# EAGLE design integratedCEE (EAGLE 5.07)
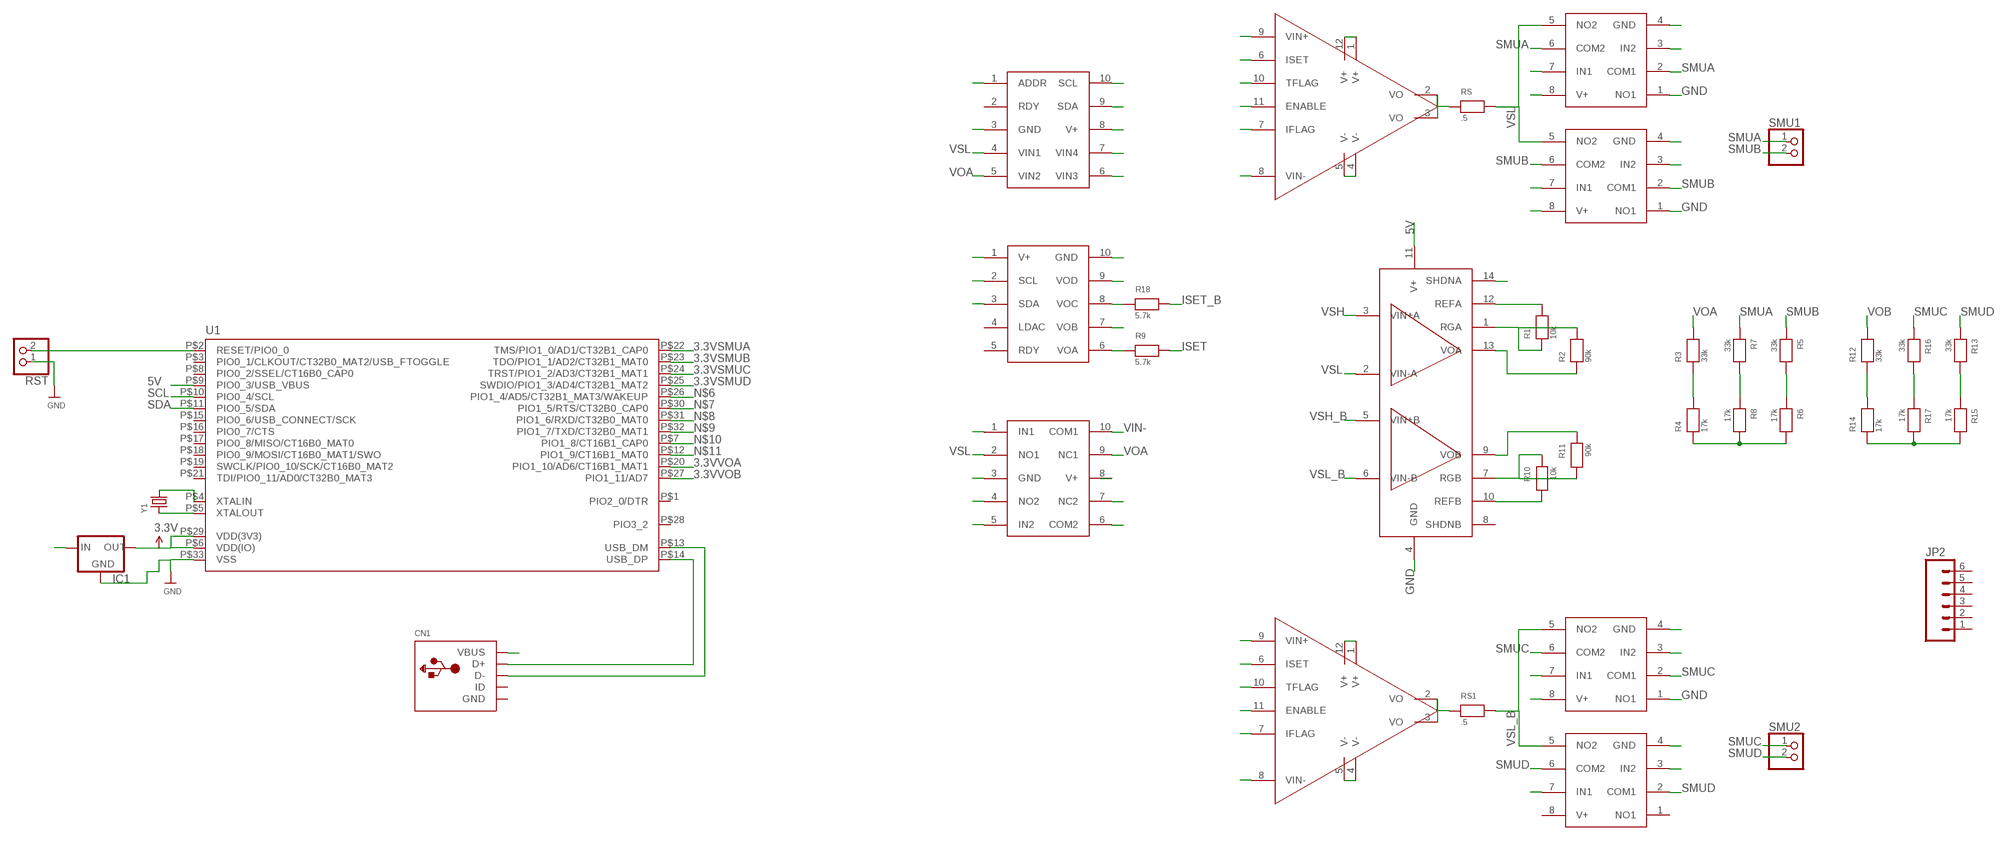
[diagram p0: schematic, sheet 1]

## Parts
ADC  ADS1015  [MSOP10]
CN1  USBMINIB  [USB-MINIB]
DAC  MCP4728  [MSOP10]
IC1  MCP1700SOT23-3  [SOT23]
INSA  INA2332  INA2332INA2332  [TSSOP14]
JP2  M06RA  [MOLEX-1X6-RA]
OPA  OPA567  [QFN12]
OPA1  OPA567  [QFN12]
R1  10k  RESISTOR0603  [0603]
R2  90k  RESISTOR0603  [0603]
R3  33k  RESISTOR0603  [0603]
R4  17k  RESISTOR0603  [0603]
R5  33k  RESISTOR0603  [0603]
R6  17k  RESISTOR0603  [0603]
R7  33k  RESISTOR0603  [0603]
R8  17k  RESISTOR0603  [0603]
R9  5.7k  RESISTOR0603  [0603]
R10  10k  RESISTOR0603  [0603]
R11  90k  RESISTOR0603  [0603]
R12  33k  RESISTOR0603  [0603]
R13  33k  RESISTOR0603  [0603]
R14  17k  RESISTOR0603  [0603]
R15  17k  RESISTOR0603  [0603]
R16  33k  RESISTOR0603  [0603]
R17  17k  RESISTOR0603  [0603]
R18  5.7k  RESISTOR0603  [0603]
RS  .5  RESISTOR2512  [2512]
RS1  .5  RESISTOR2512  [2512]
RST  HEADER-1X2ROUND  [1X02_ROUND]
SMU1  HEADER-1X2ROUND  [1X02_ROUND]
SMU2  HEADER-1X2ROUND  [1X02_ROUND]
SWA  TS5A21366  TS5A21366TS5A21366  [DCU8]
SWA1  TS5A21366  TS5A21366TS5A21366  [DCU8]
SWB  TS5A21366  TS5A21366TS5A21366  [DCU8]
SWB1  TS5A21366  TS5A21366TS5A21366  [DCU8]
SWC  TS5A23157  TS5A23157DGSR  [MSOP10]
U1  LPC1343_QFN  [HVQFN33-7X7]
Y1  CRYSTALSMD  [HC49UP]

## Nets
3.3V: IC1.2(OUT) U1.P$6(VDD(IO)) U1.P$29(VDD(3V3))
3.3VSMUA: R7.2 R8.1 U1.P$22(TMS/PIO1_0/AD1/CT32B1_CAP0)
3.3VSMUB: R5.2 R6.1 U1.P$23(TDO/PIO1_1/AD2/CT32B1_MAT0)
3.3VSMUC: R16.2 R17.1 U1.P$24(TRST/PIO1_2/AD3/CT32B1_MAT1)
3.3VSMUD: R13.2 R15.1 U1.P$25(SWDIO/PIO1_3/AD4/CT32B1_MAT2)
3.3VVOA: R3.1 R4.2 U1.P$20(PIO1_10/AD6/CT16B1_MAT1)
3.3VVOB: R12.1 R14.2 U1.P$27(PIO1_11/AD7)
5V: ADC.8(V+) CN1.VBUS DAC.1(V+) IC1.3(IN) INSA.11(V+) INSA.14(SHDNA) OPA1.1(V+) OPA1.12(V+) OPA.1(V+) OPA.12(V+) SWA1.8(V+) SWA.8(V+) SWB.8(V+) SWC.8(V+) U1.P$9(PIO0_3/USB_VBUS)
ENABLE: OPA.11(ENABLE)
ENABLE1_B: OPA1.11(ENABLE)
GND: ADC.1(ADDR) ADC.3(GND) DAC.10(GND) IC1.1(GND) INSA.4(GND) OPA1.4(V-) OPA1.5(V-) OPA.4(V-) OPA.5(V-) R4.1 R6.2 R8.2 R14.1 R15.2 R17.2 RST.1 SWA1.1(NO1) SWA1.4(GND) SWA.1(NO1) SWA.4(GND) SWB1.4(GND) SWB.1(NO1) SWB.4(GND) SWC.3(GND) U1.P$33(VSS)
IFLAG: OPA.7(IFLAG)
IFLAG1_B: OPA1.7(IFLAG)
ISET: OPA.6(ISET) R9.2
ISET_B: OPA1.6(ISET) R18.2
N$1: DAC.6(VOA) R9.1
N$2: SWC.4(NO2)
N$3: R18.1
N$4: CN1.D+ U1.P$14(USB_DP)
N$5: CN1.D- U1.P$13(USB_DM)
N$6: U1.P$26(PIO1_4/AD5/CT32B1_MAT3/WAKEUP)
N$7: U1.P$30(PIO1_5/RTS/CT32B0_CAP0)
N$8: U1.P$31(PIO1_6/RXD/CT32B0_MAT0)
N$9: U1.P$32(PIO1_7/TXD/CT32B0_MAT1)
N$10: U1.P$7(PIO1_8/CT16B1_CAP0)
N$11: U1.P$12(PIO1_9/CT16B1_MAT0)
N$12: U1.P$5(XTALOUT) Y1.1
N$13: U1.P$4(XTALIN) Y1.2
REFA: INSA.12(REFA) R1.2
REFB: INSA.10(REFB) R10.2
RESET: RST.2 U1.P$2(RESET/PIO0_0)
RGA: INSA.1(RGA) R1.1 R2.2
RGB: INSA.7(RGB) R10.1 R11.2
SCL: ADC.10(SCL) DAC.2(SCL) U1.P$10(PIO0_4/SCL)
SDA: ADC.9(SDA) DAC.3(SDA) U1.P$11(PIO0_5/SDA)
SMUA: R7.1 SMU1.1 SWA.2(COM1) SWA.6(COM2)
SMUB: R5.1 SMU1.2 SWB.2(COM1) SWB.6(COM2)
SMUC: R16.1 SMU2.1 SWA1.2(COM1) SWA1.6(COM2)
SMUD: R13.1 SMU2.2 SWB1.2(COM1) SWB1.6(COM2)
SWAIN1: SWA.7(IN1)
SWAIN2: SWA.3(IN2)
SWAIN3: SWA1.7(IN1)
SWAIN4: SWA1.3(IN2)
SWBIN1: SWB.7(IN1)
SWBIN2: SWB.3(IN2)
SWBIN3: SWB1.3(IN2)
SWBIN4: SWB1.7(IN1)
SWCIN1: SWC.1(IN1)
SWCIN1_B: SWC.5(IN2)
TFLAG: OPA.10(TFLAG)
TFLAG1_B: OPA1.10(TFLAG)
VIN+: DAC.7(VOB) OPA.9(VIN+)
VIN+_B: DAC.9(VOD) OPA1.9(VIN+)
VIN-: OPA.8(VIN-) SWC.10(COM1)
VIN-_B: OPA1.8(VIN-) SWC.6(COM2)
VOA: ADC.5(VIN2) INSA.13(VOA) R2.1 R3.2 SWC.9(NC1)
VOB: ADC.6(VIN3) INSA.9(VOB) R11.1 R12.2 SWC.7(NC2)
VSH: INSA.3(VIN+A) OPA.2(VO) OPA.3(VO) RS.1
VSH_B: INSA.5(VIN+B) OPA1.2(VO) OPA1.3(VO) RS1.1
VSL: ADC.4(VIN1) INSA.2(VIN-A) RS.2 SWA.5(NO2) SWB.5(NO2) SWC.2(NO1)
VSL_B: ADC.7(VIN4) INSA.6(VIN-B) RS1.2 SWA1.5(NO2) SWB1.5(NO2)
Unconnected: ADC.2(RDY) CN1.ID DAC.4(LDAC) DAC.5(RDY) DAC.8(VOC) INSA.8(SHDNB) JP2.1 JP2.2 JP2.3 JP2.4 JP2.5 JP2.6 SWB1.1(NO1) SWB1.8(V+) U1.P$1(PIO2_0/DTR) U1.P$3(PIO0_1/CLKOUT/CT32B0_MAT2/USB_FTOGGLE) U1.P$8(PIO0_2/SSEL/CT16B0_CAP0) U1.P$15(PIO0_6/USB_CONNECT/SCK) U1.P$16(PIO0_7/CTS) U1.P$17(PIO0_8/MISO/CT16B0_MAT0) U1.P$18(PIO0_9/MOSI/CT16B0_MAT1/SWO) U1.P$19(SWCLK/PIO0_10/SCK/CT16B0_MAT2) U1.P$21(TDI/PIO0_11/AD0/CT32B0_MAT3) U1.P$28(PIO3_2)

## Power pins joined to a net without a drawn wire
GND: CN1.GND

## Library data of the parts
ADC = nonolith:ADS1015: 12b I2C ADC: ADS1015
CN1 = adafruit:USB: USB Connectors USBMINIB - Surface Mount Female Mini-B USB Connector 4UConnector: 06564 By microbuilder.eu Thru-hole RA Female Mini-B USB Connector 4UConnector: 18732 By ladyada.net
DAC = nonolith:MCP4728: 12b I2C DAC: MCP4728
IC1 = km:MCP1700: VOLTAGE REGULATOR
INSA = nonolith:INA2332: INSAMP - 5x: INA2332
JP2 = SparkFun:M06: Header 6 Standard 6-pin 0.1" header. Use with straight break away headers (SKU : PRT-00116), right angle break away headers (PRT-00553), swiss pins (PRT-00743), machine pins (PRT-00117), and female headers (PRT-00115). Molex polarized connector foot print use with SKU : PRT-08094 with associated crimp pins and housings. NOTES ON THE VARIANTS LOCK and LOCK_LONGPADS... This footprint was designed to help hold the alignment of a through-hole component (i.e. 6-pin header) while soldering it into place. You may notice that each hole has been shifted either up or down by 0.005 of an inch from it's more standard position (which is a perfectly straight line). This slight alteration caused the pins (the squares in the middle) to touch the edges of the holes. Because they are alternating, it causes a "brace" to hold the component in place. 0.005 has proven to be the perfect amount of "off-center" position when using our standard breakaway headers. Although looks a little odd when you look at the bare footprint, once you have a header in there, the alteration is very hard to notice. Also, if you push a header all the way into place, it is covered up entirely on the bottom side. This idea of altering the position of holes to aid alignment will be further integrated into the Sparkfun Library for other footprints. It can help hold any component with 3 or more connection pins.
OPA OPA1 = nonolith:OPA567: OPA567: 2a RRIO CMOS OPA / QFN12
R1-R18 RS RS1 = nonolith:RESISTOR: Resistors 0402 - 0402 Surface Mount Package 10.0K 1% 1/16W [Digikey: 311-10.0KLRTR-ND] 0603 - 0603 Surface Mount Package 0 Ohm 1/10 Watt 1% Resistor 15 Ohm 1/10 Watt 1% Resistor 33 Ohm 1/10 Watt 1% Resistor 49.9 Ohm 1/10 Watt 1% Resistor 100 Ohm 1/10 Watt 1% Resistor 150 Ohm 1/10 Watt 1% Resistor 240 Ohm 1/10 Watt 1% Resistor 390 Ohm 1/10 Watt 1% Resistor 560 Ohm 1/10 Watt 1% Resistor 750 Ohm 1/10 Watt 1% Resistor 1.0K Ohm 1/10 Watt 1% Resistor 1.5K Ohm 1/10 Watt 1% Resistor 2.0K Ohm 1/10 Watt 1% Resistor 4.7K Ohm 1/10 Watt 1% Resistor 10.0K Ohm 1/10 Watt 1% Resistor 20.0K Ohm 1/10 Watt 1% Resistor 33.0K Ohm 1/10 Watt 1% Resistor 100.0K Ohm 1/10 Watt 1% Resistor 0805 - 0805 Surface Mount Package 0 Ohm 1/8 Watt 1% Resistor 33 Ohm 1/8 Watt 1% Resistor 100 Ohm 1/8 Watt 1% Resistor 150 Ohm 1/8 Watt 1% Resistor 200 Ohm 1/8 Watt 1% Resistor 240 Ohm 1/8 Watt 1% Resistor 330 Ohm 1/8 Watt 1% Resistor 390 Ohm 1/8 Watt 1% Resistor 470 Ohm 1/8 Watt 1% Resistor 1.0K Ohm 1/8 Watt 1% Resistor 1.5K Ohm 1/8 Watt 1% Resistor 2.0K Ohm 1/8 Watt 1% Resistor 4.7K Ohm 1/8 Watt 1% Resistor 5.1K Ohm 1/8 Watt 1% Resistor 5.6K Ohm 1/8 Watt 1% Resistor 10.0K Ohm 1/8 Watt 1% Resistor 22.0K Ohm 1/8 Watt 1% Resistor 33.0K Ohm 1/8 Watt 1% Resistor 100K Ohm 1/8 Watt 1% Resistor 1206 - 1206 Surface Mount Package
RST SMU1 SMU2 = nonolith:HEADER-1X2: PIN HEADER
SWA SWA1 SWB SWB1 = nonolith:TS5A21366: 200ma digitally controlled switch: TS5A21366
SWC = nonolith:TS5A23157DGSR: DUAL SPDT SWITCH: TS5A23157DGSR
U1 = nonolith:LPC1343_QFN: LPC1343 72 MHz 32-bit ARM Cortex-M3 based microcontroller featuring a high level of integration and low power consumption. 32 kB Flash, 8 kB SRAM, USB Device MarcVl - Datasheet available on www.nxp.com
Y1 = nonolith:CRYSTAL: Crystals HC49UP - Surface Mount Crystal 4.0MHz 18pF +/-30ppm Surface Mount Crystal [Digikey: 535-9857-1-ND] 12.0 MHz Surface Mount Crystal [Digikey: 535-9869-6-ND] 25.0 MHz Surface Mount Crystal [Digikey: 535-9078-1-ND] 3.2 x 2.5mm - MEMs SMT Crystal 12.0 MHz 8pF 15ppm 3.2 x 2.5mm Crystal [Digikey: 644-1047-1-ND] 16.0 MHz 8pF 15ppm 3.2 x 2.5mm Crystal [Digikey: 644-1049-1-ND] 16.0 MHz 10pF 10ppm 3.2 x 2.5mm Crystal [Digikey: 644-1100-1-ND] 27.12 MHz 18pF 30ppm 3.2 x 2.5mm Crystal [Digikey: 887-1424-1-ND] 4.9 x 1.8mm - MEMs SMT Crystal 32.768 KHz 12.5pF 20ppm 4.9 x 1.8mm Crystal [Digikey: SE2415CT-ND] Cylinder 32.768KHz Cylinder Crystal

## Net classes
0 default: width 0.254 mm
1 thick: width 0.356 mm

## Board
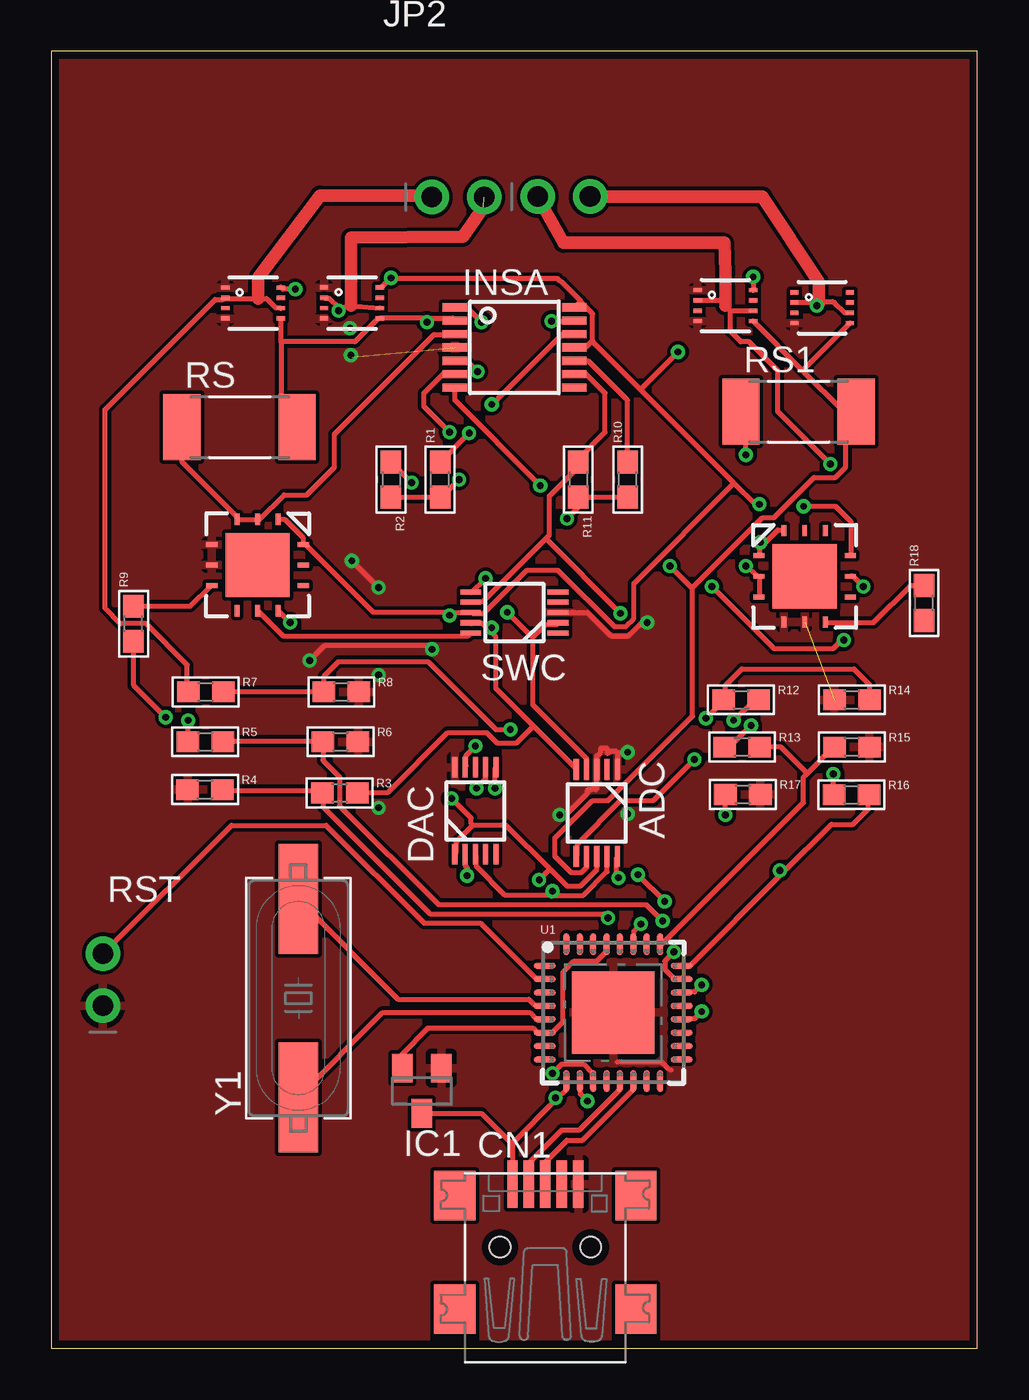
[diagram p1: board, top side]
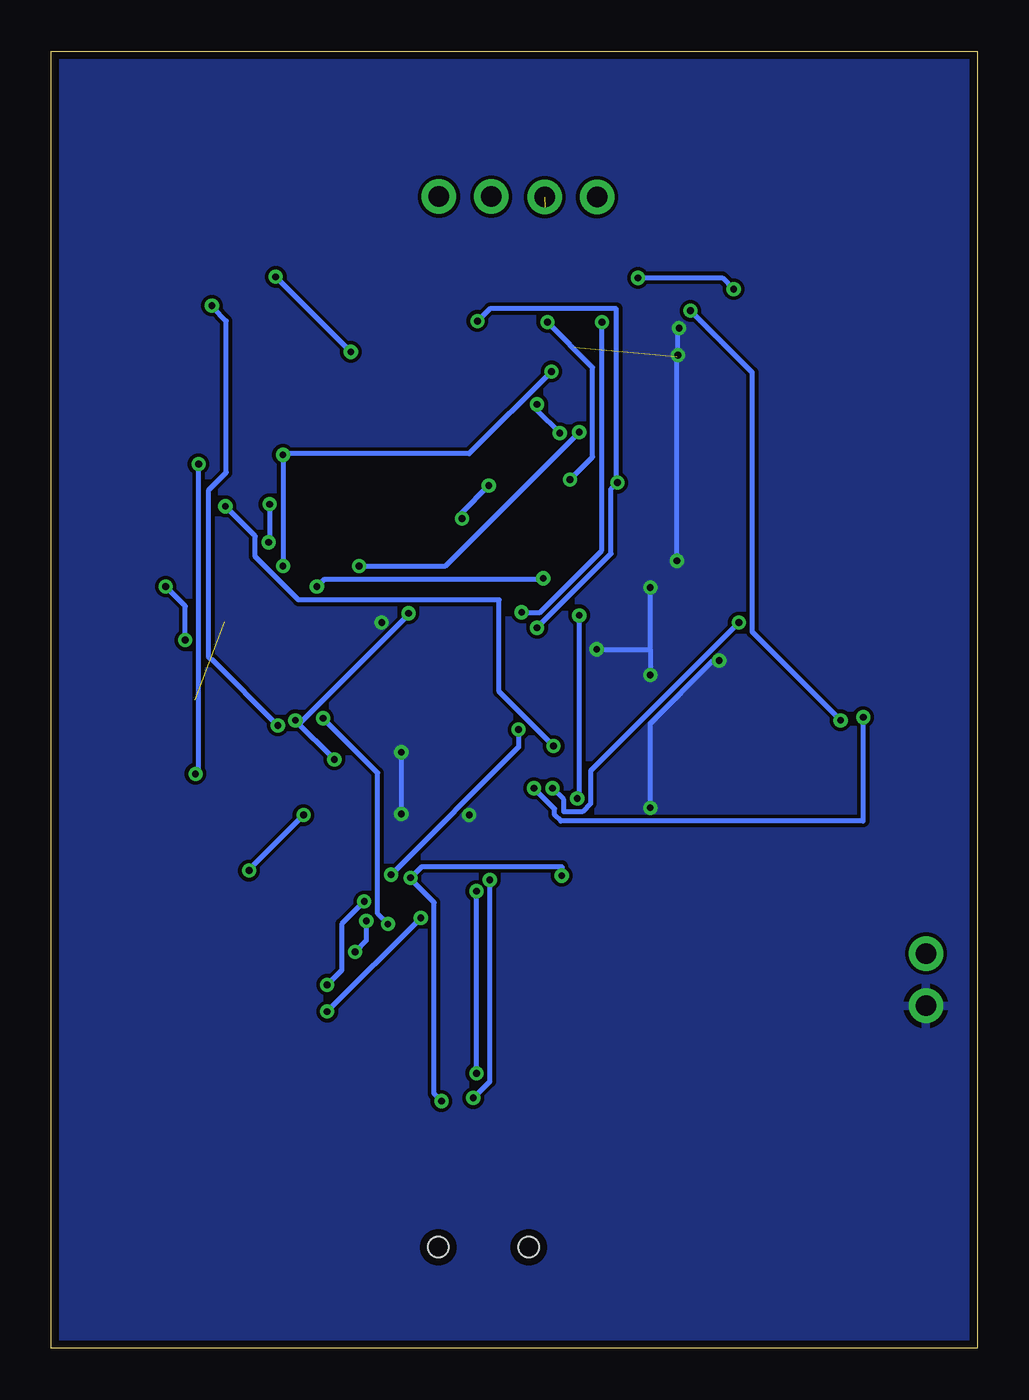
[diagram p2: board, bottom side, seen from below]

Size 45 x 63 mm. Coordinates in mm from the lower left corner, seen from the top.
Outline: 0,0 45,0 45,63 0,63 0,0
Copper layers (1*16): Top 0.0356mm / dielectric 1.5011mm / Bottom 0.0356mm
Design rules "LaenPCBOrder": minimum track width 6mil, minimum drill 13mil, track to track 6mil, track to pad 6mil, pad to pad 6mil, via to via 6mil, smd to smd 6mil, copper to edge 15mil, drill to drill 6mil, minimum pad ring 7mil, minimum via ring 7mil, stop-mask expansion 4mil, vias tented up to drill 0mil, thermal gap 10mil
Holes 3.05 mm at 45.5,82.2 53.6,15.7 -7.1,17.5 0.12,82.97

### Footprints (pad centres in the part's own frame; a part is rotated, then mirrored left to right if it is on the bottom)
MSOP10 = smd 0.25 x 1: 1 -1,-2.113; 2 -0.5,-2.113; 3 0,-2.113; 4 0.5,-2.113; 5 1,-2.113; 6 1,2.113; 7 0.5,2.113; 8 0,2.113; 9 -0.5,2.113; 10 -1,2.113
USB-MINIB = smd 0.5 x 2.308: D+ 0,4.064; D- -0.8,4.064; GND 1.6,4.064; ID 0.8,4.064; VBUS -1.6,4.064 | smd 2 x 2.4: GND1 -4.4,-2; GND2 -4.4,3.5; GND3 4.4,3.5; GND4 4.4,-2 | hole 1: -2.2,1; 2.2,1
SOT23 = smd 1 x 1.4: 1 -0.95,-1.1; 2 0.95,-1.1; 3 0,1.1
TSSOP14 = smd 0.4 x 1.2: 1 -1.95,-2.9; 2 -1.3,-2.9; 3 -0.65,-2.9; 4 0,-2.9; 5 0.65,-2.9; 6 1.3,-2.9; 7 1.95,-2.9; 8 1.95,2.9; 9 1.3,2.9; 10 0.65,2.9; 11 0,2.9; 12 -0.65,2.9; 13 -1.3,2.9; 14 -1.95,2.9
MOLEX-1X6-RA = drill 1.016 pad 1.88 square: 1 0,0 | drill 1.016 pad 1.88 round: 2 2.54,0; 3 5.08,0; 4 7.62,0; 5 10.16,0; 6 12.7,0
QFN12 = smd 0.55 x 0.24: 1 0.275,3.5; 2 0.275,2.5; 3 0.275,1.5; 7 4.725,1.5; 8 4.725,2.5; 9 4.725,3.5 | smd 0.24 x 0.55: 4 1.5,0.275; 5 2.5,0.275; 6 3.5,0.275; 10 3.5,4.725; 11 2.5,4.725; 12 1.5,4.725 | smd 3.12 x 3.12: P$1 2.5,2.5
0603 = smd 1.1 x 1: 1 -0.85,0; 2 0.85,0
2512 = smd 1.8 x 3.2: 1 -2.8,0; 2 2.8,0
1X02_ROUND = drill 1 pad 1.676 round: 1 -1.27,0; 2 1.27,0
DCU8 = smd 0.4 x 0.21: 1 -2.7,1.5; 2 -2.7,1; 3 -2.7,0.5; 4 -2.7,0; 5 0,0; 6 0,0.5; 7 0,1; 8 0,1.5
HVQFN33-7X7 = smd 1.067 x 0.3: P$1 -3.327,2.275; P$2 -3.327,1.625; P$3 -3.327,0.975; P$4 -3.327,0.325; P$5 -3.327,-0.325; P$6 -3.327,-0.975; P$7 -3.327,-1.625; P$8 -3.327,-2.275; P$17 3.327,-2.275; P$18 3.327,-1.625; P$19 3.327,-0.975; P$20 3.327,-0.325; P$21 3.327,0.325; P$22 3.327,0.975; P$23 3.327,1.625; P$24 3.327,2.275 | smd 0.3 x 1.067: P$9 -2.275,-3.327; P$10 -1.625,-3.327; P$11 -0.975,-3.327; P$12 -0.325,-3.327; P$13 0.325,-3.327; P$14 0.975,-3.327; P$15 1.625,-3.327; P$16 2.275,-3.327; P$25 2.275,3.327; P$26 1.625,3.327; P$27 0.975,3.327; P$28 0.325,3.327; P$29 -0.325,3.327; P$30 -0.975,3.327; P$31 -1.625,3.327; P$32 -2.275,3.327 | smd 4 x 4: P$33 0,0
HC49UP = smd 5.334 x 1.93: 1 -4.826,0; 2 4.826,0

### Placement (x,y rotation side)
ADC  26.5,26 180 top
CN1  24,3.9 0 top
DAC  20.6,26.1 0 top
IC1  18,12.5 180 top
INSA  22.5,48.62 270 top
JP2  17,67 0 top  (outside the outline)
OPA  7.52,40.55 270 top
OPA1  34.1,35 0 top
R1  18.89,42.2 90 top
R2  16.5,42.2 270 top
R3  14.01,26.97 0 top
R4  7.46,27.13 0 top
R5  7.47,29.46 0 top
R6  14.05,29.46 0 top
R7  7.5,31.88 0 top
R8  14.09,31.88 0 top
R9  3.99,35.19 90 top
R10  28,42.2 90 top
R11  25.6,42.2 270 top
R12  33.51,31.5 0 top
R13  33.56,29.2 0 top
R14  38.9,31.5 0 top
R15  38.9,29.2 0 top
R16  38.88,26.88 0 top
R17  33.6,26.9 0 top
R18  42.4,36.2 90 top
RS  9.14,44.75 0 top
RS1  36.3,45.5 0 top
RST  2.5,17.9 90 top
SMU1  19.76,55.92 0 top
SMU2  24.9,55.95 0 top
SWA  11.15,50.02 0 top
SWA1  34.1,49.9 0 top
SWB  15.95,50.03 0 top
SWB1  38.8,49.8 0 top
SWC  22.5,35.74 90 top
U1  27.3,16.3 0 top
Y1  12,17 90 top

### Tracks (layer width: path | path; a pad name or v marks a point on that pad's centre or on a via)
3.3V
  Top 0.254: U1.P$29 26.95,19.6 26.95,19.25 26.5,18.8 25.4,18.8 24.85,18.25 24.85,15.85 24.35,15.35 24,15.35 U1.P$6 23.85,15.35 23.6,15.35 23.4,15.55 18.3,15.55 17.05,14.3 IC1.2
3.3VSMUA  (via drill 0.33)
  Top 0.254: v31.6,17.65 31.25,17.3 30.65,17.3 U1.P$22 | v28.5,23 v29.8,21.7 | v22.3,30.05 21.6,30.05 18.3,33.35 13.95,33.35 13.25,32.65 13.25,31.9 R8.1 13.15,31.9 8.35,31.9 R7.2
  Bottom 0.254: v31.6,17.65 30.9,18.35 30.9,20.6 v29.8,21.7 | v28.5,23 22.3,29.2 v22.3,30.05
3.3VSMUB  (via drill 0.33)
  Top 0.254: v30.25,19.25 29.8,18.8 29.8,18.4 30.25,17.95 30.6,17.95 U1.P$23 | v29.7,20.75 28.9,21.55 18.8,21.55 14,26.35 14,27.75 13.2,28.55 R6.1 13.1,29.5 8.35,29.5 R5.2
  Bottom 0.254: v30.25,19.25 29.7,19.8 v29.7,20.75
3.3VSMUC  (via drill 0.33)
  Top 0.254: 35.52,23.07 37.9,25.45 38.95,25.45 39.7,26.2 39.7,26.85 R16.2 | 35.52,23.07 31,18.55 30.65,18.55 U1.P$24 | v32.75,25.9 R17.1 | 35.52,23.07 v35.4,23.2
  Bottom 0.254: v32.75,25.9 35.4,23.25 v35.4,23.2
3.3VSMUD
  Top 0.254: 36.73,27.93 38,29.2 R15.1 | 36.73,27.93 36.55,27.75 36.55,26.5 29.7,19.65 29.6,19.65 U1.P$25 | R13.2 35.45,29.2 36.73,27.93
3.3VVOA  (via drill 0.33)
  Top 0.254: v31.6,16.35 31.25,16 30.65,16 U1.P$20 | v27.05,20.9 26.85,21.1 18.4,21.1 13.2,26.3 13.2,26.95 R3.1 13.15,27.1 8.35,27.1 R4.2
  Bottom 0.254: v27.05,20.9 v31.6,16.35
3.3VVOB  (via drill 0.33)
  Top 0.254: v28.65,20.6 28.3,20.25 28.3,19.65 U1.P$27 | v31.8,30.6 32.7,31.5 R12.1 32.75,31.6 32.75,32.2 33.55,33 39,33 39.75,32.25 R14.2
  Bottom 0.254: v28.65,20.6 29.15,21.1 29.15,27.95 v31.8,30.6
5V  (via drill 0.33)
  Top 0.254: 11.15,51.55 SWA.8 11.25,51.45 v11.85,51.45 | 16,51.55 SWB.8 16.1,51.6 v16.5,52 16.6,51.95 24.6,51.95 24.7,51.85 24.8,51.8 25.73,50.88 25.7,50.85 | 34.58,39.02 35.3,39.75 35.6,39.75 OPA1.12 | 34.58,39.02 34.4,38.85 34.4,38.5 OPA1.1 | 25.7,50.85 25.4,50.55 INSA.14 | 26.27,48.92 26.3,48.95 26.3,50.25 25.7,50.85 | 26.27,48.92 26,48.65 25.4,48.65 INSA.11 | v34.4,41 34.2,41 33.17,42.02 | v34.45,39.15 34.58,39.02 | 33.17,42.02 28.62,46.58 | 28.62,46.58 26.27,48.92 | 22.4,9.95 24.55,12.1 | 24.55,12.1 25.05,12.6 25.05,12.95 U1.P$9 | 22.4,9.95 CN1.VBUS | IC1.3 20.9,11.4 22.3,10 22.4,9.95 | 20.45,25.4 19.65,24.6 19.65,24.05 DAC.1 | 20.45,25.4 22.1,25.4 24.23,23.27 | 24.23,23.27 25.05,22.45 25.7,22.45 26.5,23.25 ADC.8 | OPA.1 11.05,40.25 11.35,40.25 12.25,39.35 OPA.12 12.35,39.05 15.65,35.75 19.35,35.75 | 19.35,35.75 20.35,35.75 SWC.8 20.5,35.7 21,35.7 23.1,37.8 24.6,37.8 27.35,35.05 27.9,35.05 28.3,35.45 28.3,37.15 33.17,42.02 | v19.45,26.7 20.4,25.75 20.4,25.5 20.45,25.4 | v19.35,35.6 19.35,35.75 | 24.55,12.1 v24.5,12.15 | v23.7,22.75 24.23,23.27 | v34.1,52.05 SWA1.8 | 28.62,46.58 v30.45,48.4
  Bottom 0.254: v34.45,39.15 34.4,39.2 v34.4,41 | v19.45,26.7 19.35,26.8 v19.35,35.6 | v24.5,12.15 23.7,12.95 v23.7,22.75 | v11.85,51.45 12.4,52 v16.5,52 | v30.45,48.4 v34.1,52.05
GND  (via drill 0.33)  (2 unrouted)
  Top 0.254: SWC.3 24.65,35.75 25.1,35.75 25.28,35.74 25.4,35.75 26.05,35.75 27.2,34.6 28.05,34.6 28.7,35.25 v28.95,35.25 | 30.11,13.49 29.95,13.6 29.65,13.9 27.7,13.9 27.5,13.89 | v15.9,36.95 v14.6,38.25 | v18.5,33.95 18.3,34.15 13.3,34.15 v12.55,33.4 | 27.5,28.95 27.45,29 27.15,29 27.05,28.9 27,28.9 27,29.15 26.7,29.15 26.7,28.95 26.6,28.85 26.5,28.78 26.5,28.6 ADC.3 26.5,27.15 26.4,27.15 26.4,27.3 26.35,27.3 26.35,27.2 26.3,27.15 26.1,27.15 26.05,27.1 26.05,26.95 25,25.9 v24.7,25.9 | 27.5,28.95 ADC.1 | 27.5,28.95 v28,28.95
  Bottom 0.254: v14.5,49.55 14.5,49.45 14.55,49.4 v14.55,48.25 14.6,48.15 v14.6,38.25 | 15.9,33.95 v15.9,32.7 | 15.9,33.95 v15.9,36.95 | v12.55,33.4 12.85,33.4 15.9,30.35 v15.9,26.25 | v18.5,33.95 15.9,33.95 | v28,28.95 v28,25.95
  pour Bottom (isolate 0.178): 45,63 45,0 0,0 0,63
  pour Top (isolate 0.178): 45,63 45,0 0,0 0,63
ISET
  Top 0.254: OPA.6 7.75,37.05 6.75,36.05 R9.2
ISET_B
  Top 0.254: R18.2 41.75,37.05 39.95,35.25 37.6,35.25 OPA1.6
N$1  (via drill 0.33)
  Top 0.254: v21.55,27.2 21.55,28.15 DAC.6 | v5.55,30.65 4,32.2 4,34.3 R9.1
  Bottom 0.254: v21.55,27.2 20.55,26.2 20.55,25.9 20.25,25.6 5.55,25.6 v5.55,30.65
N$4
  Top 0.254: U1.P$14 28.25,12.95 28.25,12.55 25.8,10.1 25.05,10.1 24,9.05 CN1.D+
N$5
  Top 0.254: U1.P$13 27.6,12.95 27.6,12.55 25.65,10.6 24.8,10.6 23.2,9 CN1.D-
N$12
  Top 0.254: U1.P$5 23.95,16 23.55,16 23.25,16.3 16.1,16.3 12,12.2 Y1.1
N$13
  Top 0.254: U1.P$4 23.95,16.65 23.5,16.65 23.2,16.95 16.85,16.95 12,21.8 Y1.2
REFA  (via drill 0.33)
  Top 0.254: v20.3,44.45 R1.2 | v21.4,45.85 24.8,49.25 25.4,49.25 INSA.12
  Bottom 0.254: v20.3,44.45 21.4,45.55 v21.4,45.85
REFB
  Top 0.254: R10.2 28,46.05 26.1,47.95 25.4,47.95 INSA.10
RESET
  Top 0.254: U1.P$2 23.95,17.95 23.55,17.95 20.85,20.65 18.1,20.65 13.35,25.4 8.75,25.4 2.5,19.15 RST.2
RGA  (via drill 0.33)
  Top 0.254: R2.2 18.85,41.35 R1.1 19,41.4 v19.8,42.2 | v20.9,49.85 20.2,50.55 19.6,50.55 INSA.1
  Bottom 0.254: v20.9,49.85 18.7,47.65 18.7,43.3 v19.8,42.2
RGB  (via drill 0.33)
  Top 0.254: R10.1 R11.2 26,41.25 v25.05,40.3 | v23.75,41.9 19.6,46.05 INSA.7
  Bottom 0.254: v23.75,41.9 25.05,40.6 v25.05,40.3
SCL  (via drill 0.33)
  Top 0.254: v27.55,22.85 27.45,22.95 27.45,23.8 27.5,23.85 ADC.10 | v20.2,22.95 20.2,23.35 20.1,23.45 DAC.2 | v26.05,12 25.7,12.35 25.7,12.95 U1.P$10
  Bottom 0.254: v20.2,22.95 20.2,23.4 27,23.4 v27.55,22.85 27.5,22.75 26.4,21.65 26.4,12.35 v26.05,12
SDA  (via drill 0.33)
  Top 0.254: 24.35,22 22.05,22 20.65,23.4 20.65,23.9 20.6,23.95 DAC.3 | 24.35,22 25.85,22 27,23.15 ADC.9 | v24.35,13.35 24.8,13.8 25.85,13.8 26.3,13.35 26.3,13 U1.P$11 | v24.35,22.2 24.35,22
  Bottom 0.254: v24.35,13.35 v24.35,22.2
SMUA
  Top 0.254: SWA.6 11.1,50.55 10.9,50.55 10.45,51 10.05,51 8.45,51 SWA.2 8.35,50.95 7.95,50.95 2.6,45.6 2.6,35.95 3.35,35.2 4.6,35.2 6.6,33.2 6.6,31.9 R7.1 | 18.45,56 SMU1.1
  Top 0.61: 18.45,56 13.05,56 10.05,52 10.05,51
SMUB  (via drill 0.33)  (1 unrouted)
  Top 0.254: 13.95,50.55 14.55,50.65 SWB.6 | 13.95,50.55 13.5,51 13.3,51 SWB.2 | v6.65,30.5 6.65,29.5 R5.1 | v13.95,50.4 13.95,50.55
  Top 0.61: 14.55,50.65 14.55,53.95 20,54 21,55.42
  Bottom 0.254: v6.65,30.5 10.95,34.8 10.95,47.4 v13.95,50.4 14,50.5
SMUC  (via drill 0.33)
  Top 0.254: 33,50.4 SWA1.6 | v38,27.9 38,26.9 R16.1 | v37.85,42.95 35.3,45.5 35.3,47.5 33.9,48.9 33.5,48.9 33,49.4 33,50.4 | SWA1.2 32.5,50.9 32.75,50.65 33,50.4
  Top 0.61: SMU2.1 24.88,53.7 32.7,53.7 32.75,52.25 32.75,50.65
  Bottom 0.254: v38,27.9 37.85,28.05 v37.85,42.95
SMUD  (via drill 0.33)
  Top 0.254: SWB1.6 38.55,50.3 38.05,50.8 37.95,50.85 37.3,50.85 | v34,30.25 32.95,29.2 R13.1 | 37.2,50.8 v37.2,50.65 36.95,50.8 SWB1.2
  Top 0.61: SMU2.2 34.55,55.95 37.3,51.8 37.3,50.85 37.3,50.75 v37.2,50.65
  Bottom 0.254: v34,30.25 37.2,33.45 37.3,33.5 37.35,33.55 37.35,41.7 36.5,42.55 36.5,49.9 37.15,50.55 v37.2,50.65 37.1,50.7
VIN+  (via drill 0.33)
  Top 0.254: v11.6,35.25 11.05,35.8 OPA.9 | v20.65,27.2 21.1,27.65 DAC.7
  Bottom 0.254: v11.6,35.25 18.8,28.05 18.8,26.45 19.2,26.05 20.1,26.05 20.1,26.65 v20.65,27.2
VIN+_B  (via drill 0.33)
  Top 0.254: v36.55,40.9 38.1,40.9 38.85,40.15 38.85,38.5 OPA1.9 | v20.6,29.25 20.15,28.8 20.15,28.3 20.1,28.25 DAC.9
  Bottom 0.254: v36.55,40.9 35.1,39.45 35.1,38.45 33,36.35 23.25,36.35 23.25,31.9 v20.6,29.25
VIN-
  Top 0.254: OPA.8 10.05,35.8 11.25,34.6 20.25,34.6 20.35,34.7 SWC.10
VIN-_B  (via drill 0.33)
  Top 0.254: v39.45,37 38.95,37.5 OPA1.8 | v38.5,34.4 38.4,34.4 38,34 35.1,34 v32.1,37 | v21.1,37.4 20.4,36.7 SWC.6
  Bottom 0.254: v39.45,37 38.5,36.05 v38.5,34.4 | v32.1,37 31.75,37.35 21.1,37.35 v21.1,37.4
VOA  (via drill 0.33)
  Top 0.254: 23.43,30.23 21.6,32.05 21.6,34.55 21.27,34.88 | 23.43,30.23 25.5,28.15 ADC.5 | 21.27,34.88 20.95,35.2 20.4,35.2 SWC.9 | R3.2 14.9,27 16.35,27 19.25,29.9 21.15,29.9 21.65,29.4 22.6,29.4 23.43,30.23 | v17.5,42.05 R2.1 | 21.27,34.88 v21.4,35 | v24.3,49.9 25.4,49.9 INSA.13
  Bottom 0.254: v21.4,35 17.8,38.6 17.8,41.75 v17.5,42.05 17.55,42.15 17.55,50.5 23.7,50.5 v24.3,49.9
VOB  (via drill 0.33)
  Top 0.254: v31.25,28.6 29.25,26.6 27.65,26.6 25.55,24.5 25.55,23.95 ADC.6 | v33.15,30.5 34.15,31.5 R12.2 | 24.02,39.33 24.2,39.5 24.2,41.4 25.6,42.8 R11.1 25.55,43.15 26.9,44.5 26.9,46.4 26,47.3 25.4,47.3 INSA.9 | 24.02,39.33 20.95,36.25 SWC.7 | v27.65,35.7 24.02,39.33
  Bottom 0.254: v31.25,28.6 v33.15,30.5 32.9,30.4 27.65,35.65 v27.65,35.7
VSH
  Top 0.254: RS.1 6.35,43.05 9,40.4 OPA.3 9.05,40.25 10,40.25 OPA.2 10.1,40.25 11.3,41.45 12.4,41.45 13.75,42.8 13.75,44.4 18.6,49.25 19.6,49.25 INSA.3
VSH_B  (via drill 0.33)
  Top 0.254: OPA1.3 34.4,36.5 34.4,37.5 OPA1.2 34.25,37.55 33.8,38 v33.75,38 | v33.75,43.4 33.75,45.25 RS1.1 | v20.7,47.45 20.2,47.95 19.6,47.95 INSA.5
  Bottom 0.254: v33.75,38 v33.75,43.4 33.65,43.45 24.7,43.45 v20.7,47.45
VSL  (via drill 0.33)
  Top 0.254: 23.4,34.55 23.4,31.25 26,28.65 ADC.4 | 23.4,34.55 24,35.15 24.55,35.15 24.6,35.2 SWC.2 | 18.25,50.05 19.5,50.05 19.6,49.95 INSA.2 | 18.25,50.05 16,50.05 SWB.5 15.85,50 14.75,48.9 11.15,48.9 | 11.15,48.9 11.15,45.55 RS.2 | 11.15,48.9 11.15,50 SWA.5 | v22.15,35.75 23.3,34.6 23.4,34.55 | v18.25,49.85 18.25,50.05
  Bottom 0.254: v22.15,35.75 21.25,35.75 18.25,38.75 v18.25,49.85
VSL_B  (via drill 0.33)
  Top 0.254: 36.5,47.5 38.5,45.5 RS1.2 38.6,45.4 38.6,42.8 38.1,42.3 37.05,42.3 35.1,40.35 34.55,40.35 31.15,36.95 | 36.5,47.5 SWA1.5 | 36.5,47.5 SWB1.5 | 31.15,36.95 31.15,30.7 27.05,26.6 26.3,26.6 24.45,24.75 24.45,23.9 25.25,23.1 25.75,23.1 26,23.35 ADC.7 | v19.35,44.5 18.1,45.75 18.1,46.4 19,47.3 19.6,47.3 INSA.6 | v30.05,38 31.05,37 31.15,36.95
  Bottom 0.254: v19.35,44.5 25.85,38 v30.05,38